# Altium schematic sheet HV_Detection.SchDoc: Output Terminals & Voltage detection
size A3; DocumentNumber: 9; SheetNumber: 12; SheetTotal: 20
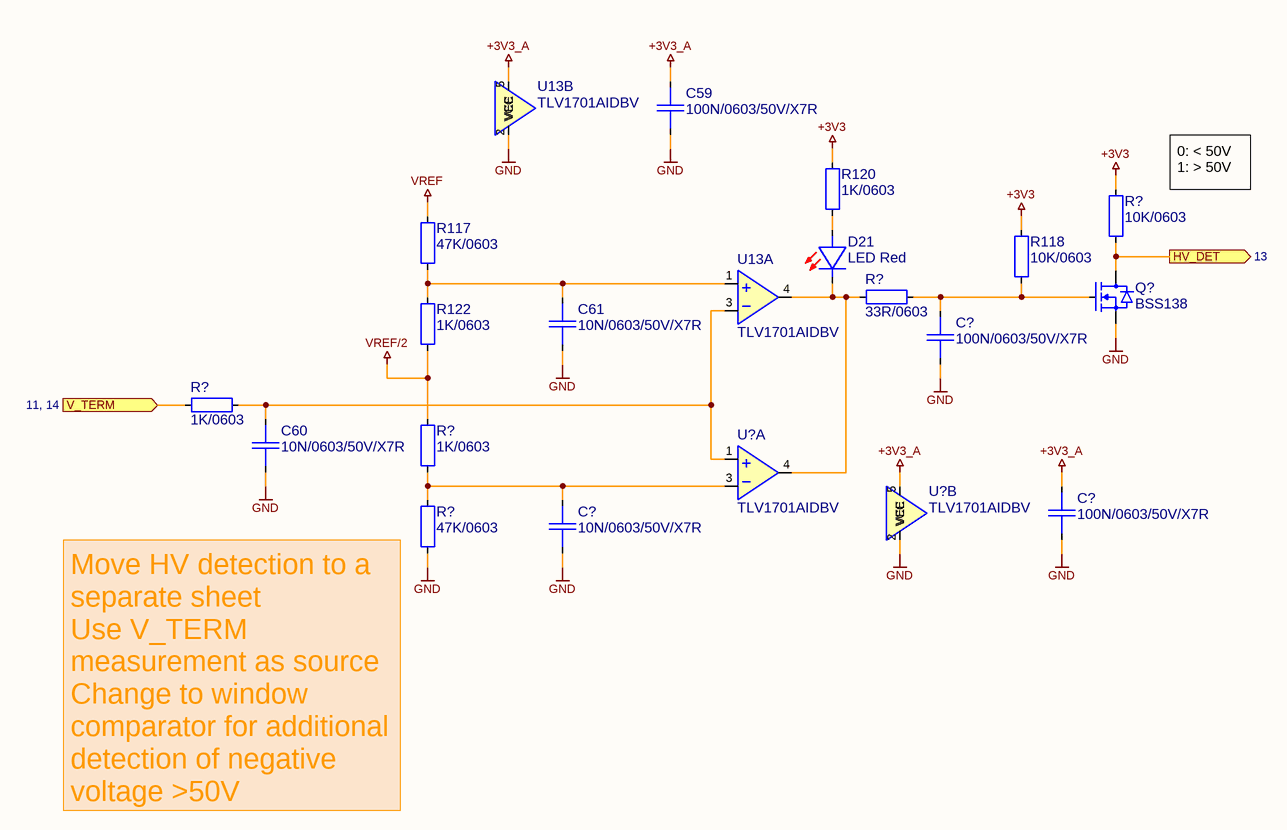
[diagram p0: HV_Detection.SchDoc]

## Parts
(Parts that share a designator on the sheet are numbered #1, #2 ... from top to bottom, then left to right.)
C59  100N/0603/50V/X7R  [CAP0603_X7R]
C60  10N/0603/50V/X7R  [CAP0603_X7R]
C61  10N/0603/50V/X7R  [CAP0603_X7R]
C?#1  100N/0603/50V/X7R  [CAP0603_X7R]
C?#2  100N/0603/50V/X7R  [CAP0603_X7R]
C?#3  10N/0603/50V/X7R  [CAP0603_X7R]
D21  LED Red  [LED0805_RED]
Q?  BSS138  [SOT2395P280X125-3-SE]
R117  47K/0603  [R0603-0.40-WW]
R118  10K/0603  [R0603-0.40-WW]
R120  1K/0603  [R0603-0.40-WW]
R122  1K/0603  [R0603-0.40-WW]
R?#1  10K/0603  [R0603-0.40-WW]
R?#2  33R/0603  [R0603-0.40-WW]
R?#3  1K/0603  [R0603-0.40-WW]
R?#4  1K/0603  [R0603-0.40-WW]
R?#5  47K/0603  [R0603-0.40-WW]
U13  TLV1701AIDBV  [SOT2395P280X125-5-NW]  (parts A,B of 2)
U?#1  TLV1701AIDBV  [SOT2395P280X125-5-NW]  (part A of 2)
U?#2  TLV1701AIDBV  [SOT2395P280X125-5-NW]  (part B of 2)

## Ports
HV_DET (out, see 13), V_TERM (in, see 11, 14)

## Nets
+3V3: R118.1 R120.2 R?#1.1
+3V3_A: C59.1 C?#2.1 U13.5(VCC) U?#2.5(VCC)
GND: C59.2 C60.2 C61.2 C?#1.2 C?#2.2 C?#3.2 Q?.2(SOURCE) R?#5.2 U13.2(VEE) U?#2.2(VEE)
VREF: R117.1
VREF/2: R122.2 R?#4.1
HV_DET: Q?.3(DRAIN) R?#1.2 ; port HV_DET
V_TERM: R?#3.1 ; port V_TERM
NetC60_1: C60.1 R?#3.2 U13.3(IN-) U?#1.1(IN+)
NetC61_1: C61.1 R117.2 R122.1 U13.1(IN+)
NetC?#1_1: C?#1.1 Q?.1(GATE) R118.2 R?#2.2
NetC?#3_1: C?#3.1 R?#4.2 R?#5.1 U?#1.3(IN-)
NetD21_1: D21.1(C) R?#2.1 U13.4(OUT) U?#1.4(OUT)
NetD21_2: D21.2(A) R120.1

## Notes on the sheet
- 0: < 50V
  1: > 50V
- (near R?#5) Move HV detection to a separate sheet
  Use V_TERM measurement as source
  Change to window comparator for additional detection of negative voltage >50V
- Date:
- Size:
- A3
- Schema:
- Layout:

## Library data of the parts
C59 C?#1 C?#2 = 100N/0603/50V/X7R: CAP SM 0603 100nF 50V X7R; Manufacturer: GENERIC; Manufacturer 1: YAGEO; Manufacturer Part Number 1: CC0603KPX7R9BB104; Absolute Value: 1E-7; Eurocircuits GPN: GPC0603104; Part Number: 100N/0603/50V/X7R; Package: 0603; Value: 100nF; HelpURL: https://www.yageo.com/upload/media/product/app/datasheet/mlcc/upy-gphc_x7r_6_3v-to-250v.pdf; Supplier 1: Digi-Key; Supplier Part Number 1: 311-3567-1-ND; Supplier 3: LCSC; Supplier Part Number 3: C14663; Manufacturer 2: YAGEO; Manufacturer Part Number 2: CC0603MRX7R9BB104; Supplier 2: Digi-Key; Supplier Part Number 2: 311-4110-1-ND; JLC Type: Basic; Manufacturer Part Number 3: CC0603KRX7R9BB104
C60 C61 C?#3 = 10N/0603/50V/X7R: CAP SM 0603 10nF 50V X7R; Manufacturer: GENERIC; Manufacturer 1: YAGEO; Manufacturer Part Number 1: CC0603KPX7R9BB103; Absolute Value: 1E-8; Eurocircuits GPN: GPC0603103; Part Number: 10N/0603/50V/X7R; Package: 0603; Value: 10nF; HelpURL: https://www.yageo.com/upload/media/product/app/datasheet/mlcc/upy-gphc_x7r_6_3v-to-250v.pdf; Supplier 1: Digi-Key; Supplier Part Number 1: 311-1572-1-ND; Manufacturer 2: YAGEO; Manufacturer Part Number 2: CC0603KRX7R9BB103; Supplier 2: Digi-Key; Supplier Part Number 2: 311-1085-1-ND; Manufacturer Part Number 3: CC0603KRX7R9BB103; Supplier 3: LCSC; Supplier Part Number 3: C100042
D21 = LED Red 0805: Generic LED Red 0805; Manufacturer 1: Würth; Manufacturer Part Number 1: 150080RS75000; Part Number: LED Red 0805; Manufacturer: GENERIC; Package: 805; Value: Red; Absolute Value: Red; HelpURL: https://www.we-online.com/katalog/datasheet/150060RS75000.pdf; Supplier 1: Digikey; Supplier Part Number 1: 732-4984-1-ND; Manufacturer 3: Foshan NationStar Optoelectronics; Manufacturer Part Number 3: NCD0805R1; Supplier 3: LCSC; Supplier Part Number 3: C84256; JLC Type: Basic
Q? = BSS138: N-Kanal 50 V 220mA (Ta) 350mW (Ta) Oberflächenmontage SOT-23; Manufacturer: GENERIC; Manufacturer 1: ANBON SEMICONDUCTOR (INT'L) LIMITED; Part Number: BSS138; Package: SOT23; HelpURL: https://mm.digikey.com/Volume0/opasdata/d220001/medias/docus/3037/BSS138.pdf; Manufacturer Part Number 1: BSS138; Supplier 1: Digi-Key; Supplier Part Number 1: 4530-BSS138CT-ND; Manufacturer 3: FOSAN; Manufacturer Part Number 3: BSS138; Supplier 3: LCSC; Supplier Part Number 3: C2926186; JLC Type: Extended; Manufacturer 2: FOSAN; Manufacturer Part Number 2: BSS138; Supplier 2: LCSC; Supplier Part Number 2: C2926186
R117 R?#5 = 47K/0603: RES SM 0603 47K; Manufacturer: GENERIC; Manufacturer 1: YAGEO; Manufacturer Part Number 1: RC0603FR-1347KL; Absolute Value: 47000; Eurocircuits GPN: GPR060347K; Part Number: 47K/0603; Package: 0603; Value: 47K; HelpURL: https://www.yageogroup.com/content/datasheet/asset/file/PYU-RC_GROUP_51_ROHS_L; Supplier 1: Digi-Key; Supplier Part Number 1: 13-RC0603FR-1347KLCT-ND; Manufacturer 2: YAGEO; Manufacturer Part Number 2: RC0603FR-1047KL; Supplier 2: Digi-Key; Supplier Part Number 2: 13-RC0603FR-1047KLCT-ND; Manufacturer 3: UNI-ROYAL(Uniroyal Elec); Manufacturer Part Number 3: 0603WAF4702T5E; Supplier 3: LCSC; Supplier Part Number 3: C25819; JLC Type: Basic
R118 R?#1 = 10K/0603: RES SM 0603 10K; Manufacturer: GENERIC; Manufacturer 1: YAGEO; Manufacturer Part Number 1: RC0603FR-1310KL; Absolute Value: 10000; Eurocircuits GPN: GPR060310K; Part Number: 10K/0603; Package: 0603; Value: 10K; HelpURL: https://www.yageogroup.com/content/datasheet/asset/file/PYU-RC_GROUP_51_ROHS_L; Supplier 1: Digi-Key; Supplier Part Number 1: 13-RC0603FR-1310KLCT-ND; Manufacturer 2: YAGEO; Manufacturer Part Number 2: RC0603FR-1010KL; Supplier 2: Digi-Key; Supplier Part Number 2: 13-RC0603FR-1010KLCT-ND; Manufacturer 3: UNI-ROYAL(Uniroyal Elec); Manufacturer Part Number 3: 0603WAF1002T5E; Supplier 3: LCSC; Supplier Part Number 3: C25804; JLC Type: Basic
R120 R122 R?#3 R?#4 = 1K/0603: RES SM 0603 1K; Manufacturer: GENERIC; Manufacturer 1: YAGEO; Manufacturer Part Number 1: RC0603FR-131KL; Absolute Value: 1000; Eurocircuits GPN: GPR06031K; Part Number: 1K/0603; Package: 0603; Value: 1K; HelpURL: https://www.yageogroup.com/content/datasheet/asset/file/PYU-RC_GROUP_51_ROHS_L; Supplier 1: Digi-Key; Supplier Part Number 1: 13-RC0603FR-131KLCT-ND; Manufacturer 2: YAGEO; Manufacturer Part Number 2: RC0603FR-101KL; Supplier 2: Digi-Key; Supplier Part Number 2: 13-RC0603FR-101KLCT-ND; Manufacturer 3: UNI-ROYAL(Uniroyal Elec); Manufacturer Part Number 3: 0603WAF1001T5E; Supplier 3: LCSC; Supplier Part Number 3: C21190; JLC Type: Basic
R?#2 = 33R/0603: RES SM 0603 33R; Manufacturer: GENERIC; Manufacturer 1: YAGEO; Manufacturer Part Number 1: RC0603FR-1333RL; Absolute Value: 33; Eurocircuits GPN: GPR060333R; Part Number: 33R/0603; Package: 0603; Value: 33R; HelpURL: https://www.yageogroup.com/content/datasheet/asset/file/PYU-RC_GROUP_51_ROHS_L; Supplier 1: Digi-Key; Supplier Part Number 1: 13-RC0603FR-1333RLCT-ND; Manufacturer 2: YAGEO; Manufacturer Part Number 2: RC0603FR-1033RL; Supplier 2: Digi-Key; Supplier Part Number 2: 13-RC0603FR-1033RLCT-ND
U13 U?#1 U?#2 = TLV1701 SOT23: TLV1701 2.2-V to 36-V, microPower Comparato; Manufacturer: Texas Instruments; Manufacturer Part Number 1: TLV1701AIDBVR; Part Number: TLV1701 SOT23; Package: SOT23-5; HelpURL: https://www.ti.com/lit/ds/symlink/tlv1701.pdf; Manufacturer 1: Texas Instruments; Supplier 1: Digi-Key; Supplier Part Number 1: 296-40599-1-ND; Manufacturer 2: Texas Instruments; Manufacturer Part Number 2: TLV1701QDBVRQ1; Supplier 2: Digi-Key; Supplier Part Number 2: 296-47458-1-ND; Manufacturer 3: Texas Instruments; Manufacturer Part Number 3: TLV1701AIDBVR; Supplier 3: LCSC; Supplier Part Number 3: C130035